# Altium schematic sheet 1_ENTRADA_DE_ALIMENTACAO.SchDoc
size Tabloid; SheetNumber: 1; SheetTotal: 5; SPICEModelCacheBKPNJEUB: <root> / <DocumentId>BKPNJEUB</DocumentId> / <CacheFrame Number="0"> / <Model Name="0603_885012206095_100nf" Kind="CKT"> / <Text>******* / .subckt 0603_885012206095_100nF 1 2 / Rser 1 3 0.0157659152881 / Lser 2 4 3.10171966E-10 / C1 3 4 0.0000001 / Rpar 3 4 5000000000 / .ends 0603_885012206095_100nF</Text> / </Model> / <Model Name="0805_150080rs75000" Kind="CKT"> / <Text>****** / .subckt 0805_150080RS75000  1  2 / D1 1 2 SMCW / .MODEL SMCW D / + IS=10.000E-21 / + N=1.6992 / + RS=1.0000E-6 / + IKF=1.2373E-3 / + CJO=1.0000E-12 / + M=.3333 / + VJ=.75 / + BV=5 / + IBV=10.00E-6 / + TT=5.0000E-9 / .ends</Text> / </Model> / <Model Name="0805_885012207103r_1uf" Kind="CKT"> / <Text>******* / .subckt 0805_885012207103R_1uF 1 2 / Rser 1 3 0.0053065272233 / Lser 2 4 2.83466289E-10 / C1 3 4 0.000001 / Rpar 3 4 100000000 / .ends 0805_885012207103R_1uF</Text> / </Model> / <Model Name="0805_885012207102_470nf" Kind="CKT"> / <Text>******* / .subckt 0805_885012207102_470nF 1 2 / Rser 1 3 0.00874819634126 / Lser 2 4 0.000000000465 / C1 3 4 0.00000047 / Rpar 3 4 1100000000 / .ends 0805_885012207102_470nF</Text> / </Model> / <Model Name="3015_78438335470_47u" Kind="CKT"> / <Text>******* / .subckt 3015_78438335470_47u 1 2 / Rp 1 2 42066.66667 / Cp 1 2 7.59833333333333p / Rs 1 N3 2.09 / L1 N3 2 46.1u / .ends 3015_78438335470_47u</Text> / </Model> / <Model Name="0603_885012206022_220nf" Kind="CKT"> / <Text>******* / .subckt 0603_885012206022_220nF 1 2 / Rser 1 3 0.0146862228843 / Lser 2 4 4.43010481E-10 / C1 3 4 0.00000022 / Rpar 3 4 2300000000 / .ends 0603_885012206022_220nF</Text> / </Model> / <Model Name="0603_885012206027_2.2uf" Kind="CKT"> / <Text>******* / .subckt 0603_885012206027_2.2uF 1 2 / Rser 1 3 0.00844425861819 / Lser 2 4 2.90335669E-10 / C1 3 4 0.0000022 / Rpar 3 4 20000000 / .ends 0603_885012206027_2.2uF</Text> / </Model> / </CacheFrame> / </root>
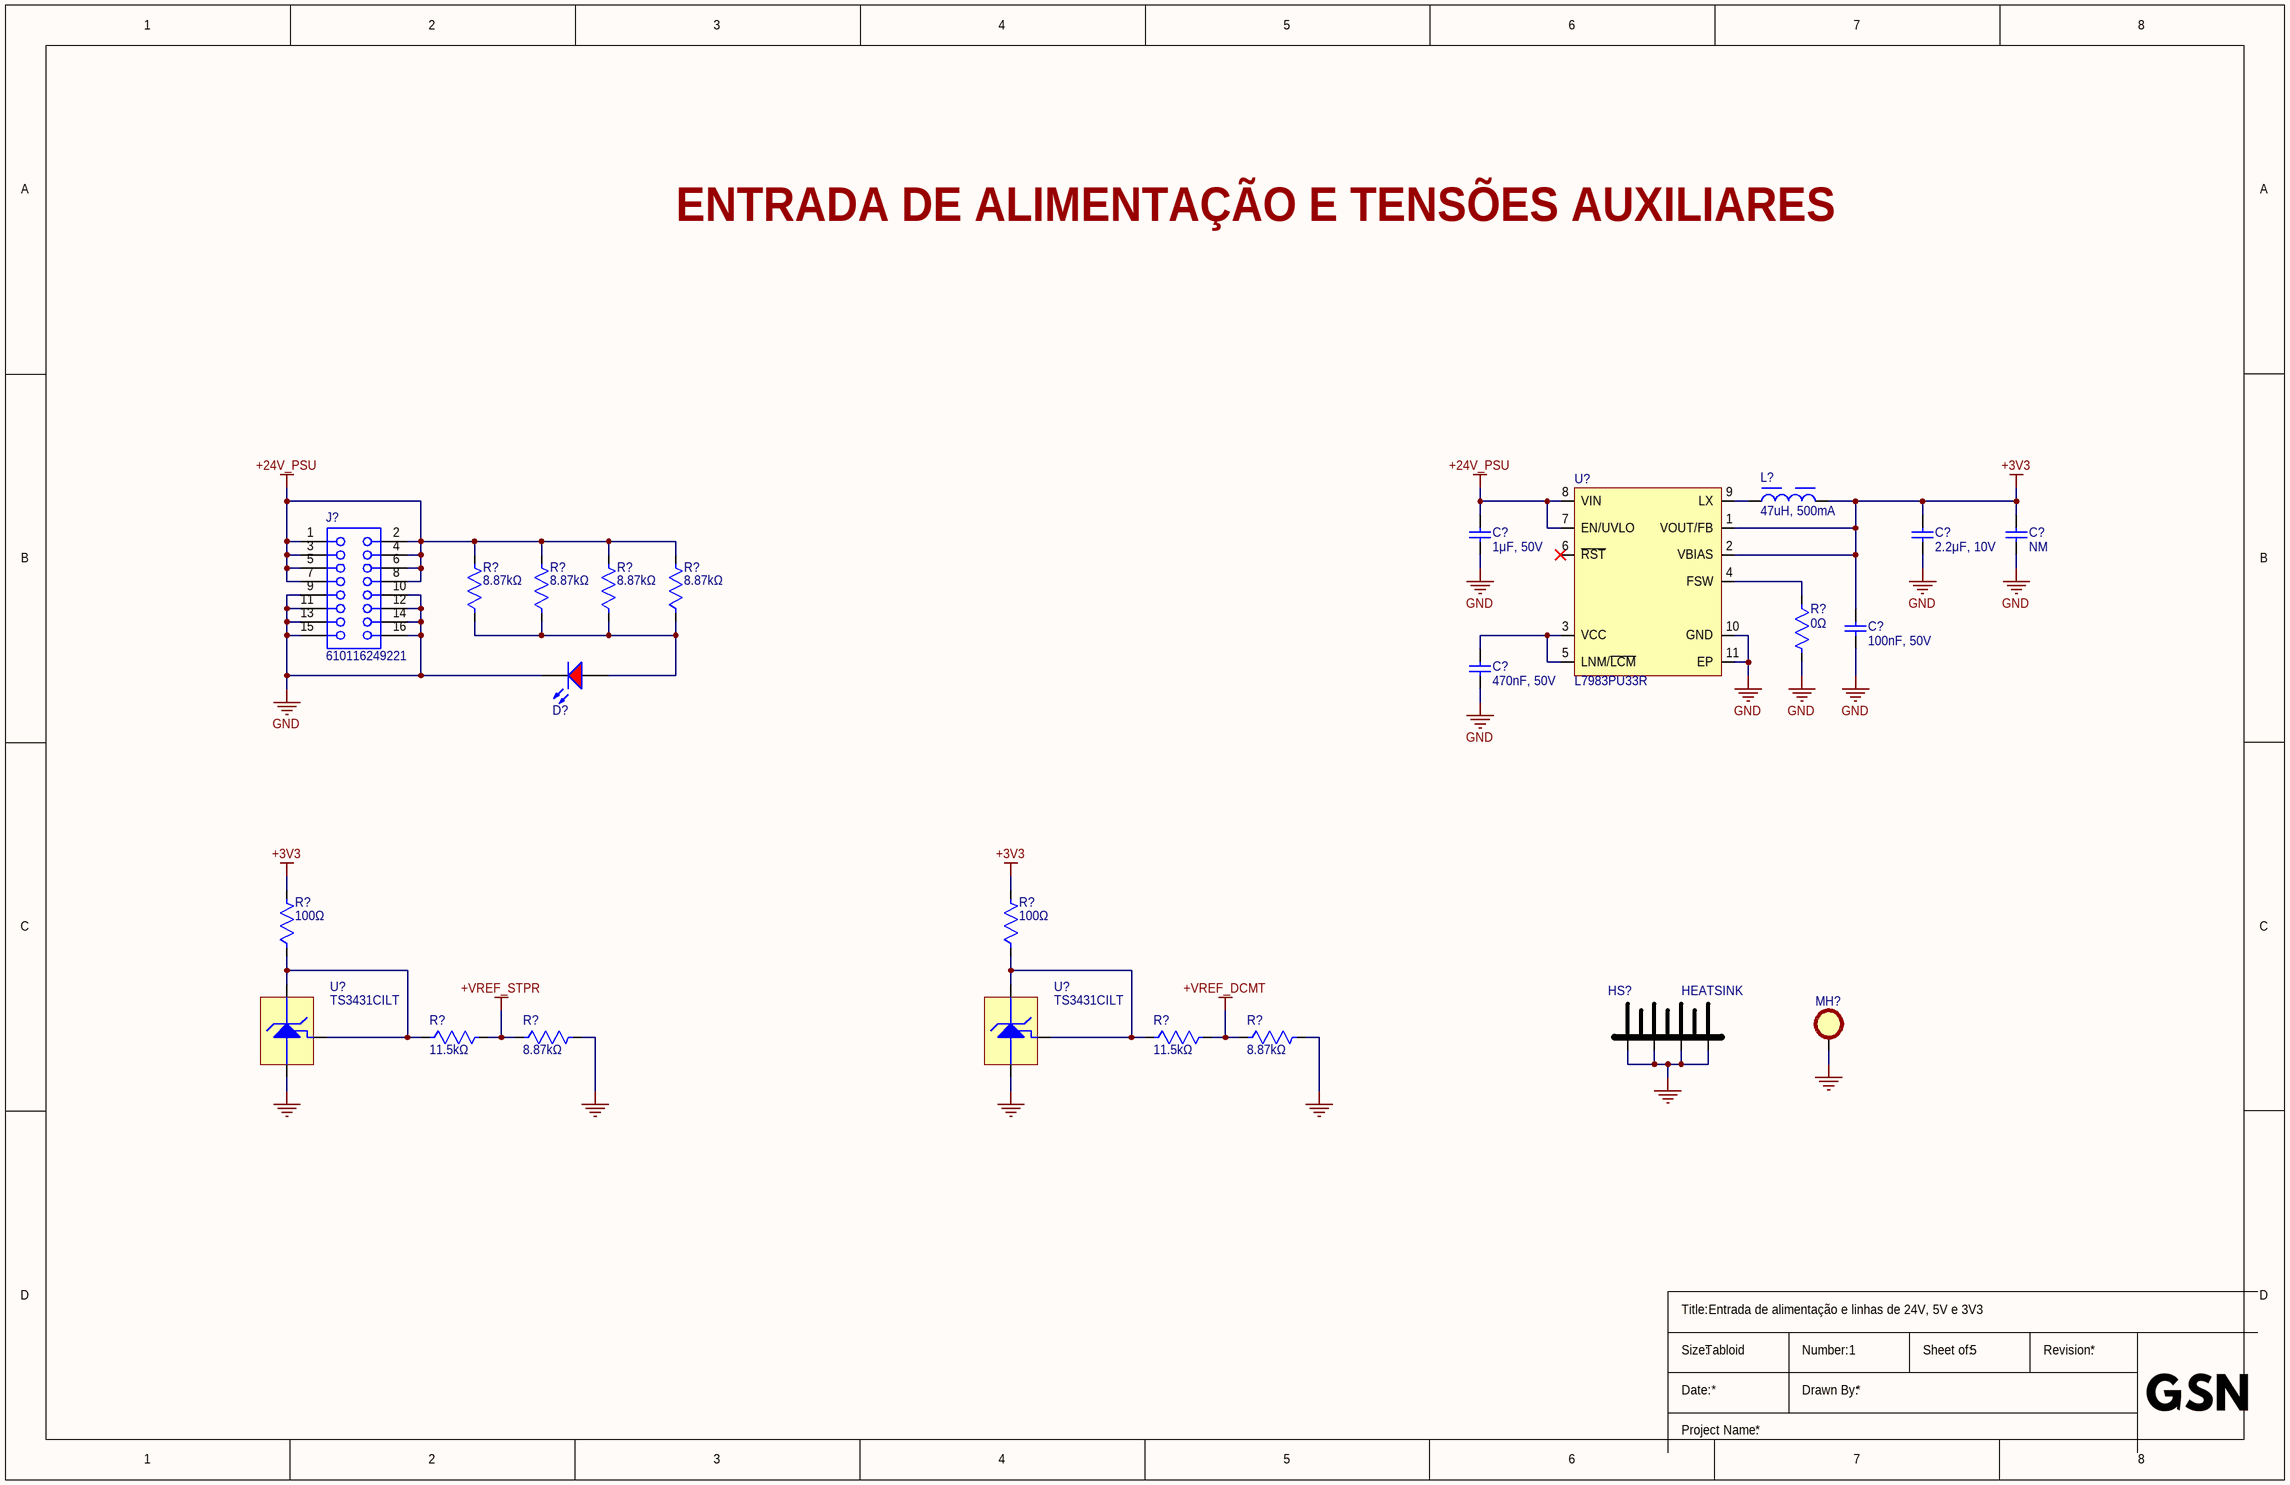
[diagram p0: 1_ENTRADA_DE_ALIMENTACAO.SchDoc]

## Parts
(Parts that share a designator on the sheet are numbered #1, #2 ... from top to bottom, then left to right.)
C?#1  1μF, 50V  [WCAP-CSGP_0805_L2W1.25H1.25]
C?#2  2.2μF, 10V  [WCAP-CSGP_0603_L1.6W0.8H0.8_Reflow]
C?#3  NM  [WCAP-CSGP_0603_L1.6W0.8H0.8_Reflow]
C?#4  100nF, 50V  [WCAP-CSGP_0603_L1.6W0.8H0.8_Reflow]
C?#5  470nF, 50V  [WCAP-CSGP_0805_L2W1.25H1.25]
D?  Red, 2V, 140°  [WL-SMCW_0805_150080xx75000]  (value not drawn)
HS?  HEATSINK  [HEATSINK_100MM_60MM_10MM_LAYING_DOWN]
J?  610116249221  [610116249221]
L?  47uH, 500mA  [WE-MAIA_3015]
MH?  Mounting Hole 2.5mm  [MOUNTING_HOLE_M2P5_PLATED]  (value not drawn)  (no BOM)
R?#1  0Ω  [0603-REFLOW]
R?#2  8.87kΩ  [0805-REFLOW]
R?#3  8.87kΩ  [0805-REFLOW]
R?#4  8.87kΩ  [0805-REFLOW]
R?#5  8.87kΩ  [0805-REFLOW]
R?#6  100Ω  [0603-REFLOW]
R?#7  100Ω  [0603-REFLOW]
R?#8  11.5kΩ  [0603-REFLOW]
R?#9  8.87kΩ  [0603-REFLOW]
R?#10  11.5kΩ  [0603-REFLOW]
R?#11  8.87kΩ  [0603-REFLOW]
U?#1  L7983PU33R  [10-WFDFN-EP]
U?#2  TS3431CILT  [SOT-23-3]
U?#3  TS3431CILT  [SOT-23-3]

## Nets
+3V3: C?#2.2 C?#3.2 C?#4.2 L?.2 R?#6.2 R?#7.2 U?#1.1(VOUT/FB) U?#1.2(VBIAS)
+24V_PSU: C?#1.2 J?.1 J?.2 J?.3 J?.4 J?.5 J?.6 J?.7 J?.8 R?#2.2 R?#3.2 R?#4.2 R?#5.2 U?#1.7(EN/UVLO) U?#1.8(VIN)
+VREF_DCMT: R?#10.2 R?#11.1
+VREF_STPR: R?#8.2 R?#9.1
GND: C?#1.1 C?#2.1 C?#3.1 C?#4.1 C?#5.1 D?.1(K) HS?.H1 HS?.H2 HS?.H3 HS?.H4 J?.9 J?.10 J?.11 J?.12 J?.13 J?.14 J?.15 J?.16 MH?.H R?#1.2 R?#9.2 R?#11.2 U?#1.10(GND) U?#1.11(EP) U?#2.3(ANODE) U?#3.3(ANODE)
NetC?#5_2: C?#5.2 U?#1.3(VCC) U?#1.5(LNM/~{LCM})
NetD?_2: D?.2(A) R?#2.1 R?#3.1 R?#4.1 R?#5.1
NetL?_1: L?.1 U?#1.9(LX)
NetR?#1_1: R?#1.1 U?#1.4(FSW)
NetR?#6_1: R?#6.1 R?#8.1 U?#2.1(REF) U?#2.2(CATHODE)
NetR?#7_1: R?#7.1 R?#10.1 U?#3.1(REF) U?#3.2(CATHODE)

Not connected (* = marked no-connect by the designer): U?#1 6(~{RST})*

## Notes on the sheet
- ENTRADA DE ALIMENTAÇÃO E TENSÕES AUXILIARES
- Entrada de alimentação e linhas de 24V, 5V e 3V3
- Title:
- Size:
- Tabloid
- Number:
- Sheet of:
- Revision:
- Date:
- Project Name:
- Drawn By:

## Library data of the parts
C?#1 = 885012207103R: WCAP-CSGP Multilayer Ceramic Chip Capacitor, General Purpose, size 0805, 1μF, 50V; Manufacturer: Wurth Elektronik; Case/Size Code: 0805; Capacitance: 1uF; Capacitance Tolerance: +/-10%; Ceramic Type: X7R; Dissipation Factor: 10%; Insulation Resistance: 0.1Gohm; Technical Reference: X7R0805105K050DFCT20000; Manufacturer Part Number: 885012207103R; Category: Multilayer Ceramic Chip Capacitors; Match Code: WCAP-CSGP; ComponentLink1Description: Website Link; ComponentLink1URL: https://www.we-online.com/redexpert/article/885012207103R?ad; ComponentLink2Description: Datasheet Link; ComponentLink2URL: https://www.we-online.com/redexpert/spec/885012207103R?ad; Mount: Surface Mount; Operating Temperature Min: -55degC; Operating Temperature Max: 125degC; Packaging: Tape and Reel; Length: 2mm; Width: 1.25mm; Height: 1.25mm; Rated Voltage (DC): 50V
C?#2 = 885012206027: WCAP-CSGP Multilayer Ceramic Chip Capacitor, General Purpose, size 0603, 2.2μF, 10V; Manufacturer: Wurth Elektronik; Case/Size Code: 0603; Capacitance: 2.2uF; Capacitance Tolerance: +/-10%; Ceramic Type: X7R; Dissipation Factor: 10%; Insulation Resistance: 0.02Gohm; Technical Reference: X7R0603225K010DFCT10000; Manufacturer Part Number: 885012206027; Category: Multilayer Ceramic Chip Capacitors; Match Code: WCAP-CSGP; ComponentLink1Description: Website Link; ComponentLink1URL: https://www.we-online.com/redexpert/article/885012206027?ad; ComponentLink2Description: Datasheet Link; ComponentLink2URL: https://www.we-online.com/redexpert/spec/885012206027?ad; Mount: Surface Mount; Operating Temperature Min: -55degC; Operating Temperature Max: 125degC; Packaging: Tape and Reel; Length: 1.6mm; Width: 0.8mm; Height: 0.8mm; Rated Voltage (DC): 10V
C?#3 = 885012206022: WCAP-CSGP Multilayer Ceramic Chip Capacitor, General Purpose, size 0603, 220nF, 10V; Manufacturer: Wurth Elektronik; Case/Size Code: 0603; Capacitance Tolerance: +/-10%; Ceramic Type: X7R; Dissipation Factor: 5%; Insulation Resistance: 2.3Gohm; Technical Reference: X7R0603224K010DFCT10000; Manufacturer Part Number: 885012206022; Category: Multilayer Ceramic Chip Capacitors; Match Code: WCAP-CSGP; ComponentLink1Description: Website Link; ComponentLink1URL: https://www.we-online.com/redexpert/article/885012206022?ad; ComponentLink2Description: Datasheet Link; ComponentLink2URL: https://www.we-online.com/redexpert/spec/885012206022?ad; Mount: Surface Mount; Operating Temperature Min: -55degC; Operating Temperature Max: 125degC; Packaging: Tape and Reel; Length: 1.6mm; Width: 0.8mm; Height: 0.8mm; Capacitance: 220nF; Rated Voltage (DC): 10V
C?#4 = 885012206095: WCAP-CSGP Multilayer Ceramic Chip Capacitor, General Purpose, size 0603, 100nF, 50V; Manufacturer: Wurth Elektronik; Case/Size Code: 0603; Capacitance Tolerance: +/-10%; Ceramic Type: X7R; Dissipation Factor: 3%; Insulation Resistance: 5Gohm; Technical Reference: X7R0603104K050DFCT10000; Manufacturer Part Number: 885012206095; Category: Multilayer Ceramic Chip Capacitors; Match Code: WCAP-CSGP; ComponentLink1Description: Website Link; ComponentLink1URL: https://www.we-online.com/redexpert/article/885012206095?ad; ComponentLink2Description: Datasheet Link; ComponentLink2URL: https://www.we-online.com/redexpert/spec/885012206095?ad; Mount: Surface Mount; Operating Temperature Min: -55degC; Operating Temperature Max: 125degC; Packaging: Tape and Reel; Length: 1.6mm; Width: 0.8mm; Height: 0.8mm; Capacitance: 100nF; Rated Voltage (DC): 50V
C?#5 = 885012207102: WCAP-CSGP Multilayer Ceramic Chip Capacitor, General Purpose, size 0805, 470nF, 50V; Manufacturer: Wurth Elektronik; Case/Size Code: 0805; Capacitance Tolerance: +/-10%; Ceramic Type: X7R; Dissipation Factor: 3%; Insulation Resistance: 1.1Gohm; Technical Reference: X7R0805474K050DFCT10000; Manufacturer Part Number: 885012207102; Category: Multilayer Ceramic Chip Capacitors; Match Code: WCAP-CSGP; ComponentLink1Description: Website Link; ComponentLink1URL: https://www.we-online.com/redexpert/article/885012207102?ad; ComponentLink2Description: Datasheet Link; ComponentLink2URL: https://www.we-online.com/redexpert/spec/885012207102?ad; Mount: Surface Mount; Operating Temperature Min: -55degC; Operating Temperature Max: 125degC; Packaging: Tape and Reel; Length: 2mm; Width: 1.25mm; Height: 1.25mm; Capacitance: 470nF; Rated Voltage (DC): 50V
D? = 150080RS75000: WL-SMCW Mono-color Chip LED Waterclear, SMT, size 0805, Red, 2V, 140°; Manufacturer: Wurth Elektronik; Case/Size Code: 0805; Chip Technology: AlInGaP; Dominant Wavelength: 625nm; Luminous Intensity: 150mcd; Peak Wavelength: 630nm; Manufacturer Part Number: 150080RS75000; Category: Signal LEDs; Match Code: WL-SMCW; ComponentLink1Description: Website Link; ComponentLink1URL: https://www.we-online.com/redexpert/article/150080RS75000?ad; ComponentLink2Description: Datasheet Link; ComponentLink2URL: https://www.we-online.com/redexpert/spec/150080RS75000?ad; Mount: Surface Mount; Min Operating Temperature: -40°C; Max Operating Temperature: 85°C; Packaging: Tape and Reel; Length: 2mm; Width: 1.25mm; Height: 0.7mm; Emitting Color: Red; Forward Voltage: 2V; Viewing Angle: 140°
HS? = GENERIC-HEATSINK-100X60X10MM-LD: GENERIC HEATSINK 100X60X10MM; Manufacturer: OEM; Manufacturer Part Number: None
J? = 610116249221: WR-PHD Socket Header, SMT, Angled, pitch 2.54mm, 2 Row, 16P; Manufacturer: Wurth Elektronik; Contact Resistance: 20mOhm; Rated Current: 3A; Working Voltage: 250V; Withstanding Voltage: 600V; Manufacturer Part Number: 610116249221; Category: Board-to-Board Connectors; Match Code: WR-PHD; ComponentLink1Description: Website Link; ComponentLink1URL: https://www.we-online.com/redexpert/article/610116249221?ad; ComponentLink2Description: Datasheet Link; ComponentLink2URL: https://www.we-online.com/redexpert/spec/610116249221?ad; Mount: Surface Mount; Operating Temperature Min: -40degC; Operating Temperature Max: 105degC; Packaging: Tape and Reel; Gender: Socket Header; Number of Pins: 16; Number of Rows: 2; Orientation: Angled; Lead Pitch: 2.54mm
L? = 78438335470: WE-MAIA SMT Power Inductor, size 3015, 47uH, 0.5A, 2300mohm; Manufacturer: Wurth Elektronik; Case/Size Code: 3015; Saturation Current @ 10%: 0.75A; Saturation Current @ 30%: 1.5A; Self Resonant Frequency: 8MHz; Manufacturer Part Number: 78438335470; Category: Power Inductors; Match Code: WE-MAIA; ComponentLink1Description: Website Link; ComponentLink1URL: https://www.we-online.com/redexpert/article/78438335470?ad; ComponentLink2Description: Datasheet Link; ComponentLink2URL: https://www.we-online.com/redexpert/spec/78438335470?ad; Mount: Surface Mount; Operating Temperature Min: -40degC; Operating Temperature Max: 125degC; Packaging: Tape and Reel; Length: 3mm; Width: 3mm; Height: 1.5mm; Automotive: Yes; DC Resistance Max: 2300mohm; Inductance: 47uH; Rated Current: 0.5A
MH? = MTH-2P5MM-PLATED: PLATED MOUNTING HOLE WITH 2.5MM DIAMETER
R?#1 = RC0603FR-070RL: RES 0 OHM 1% 1/10W 0603; Manufacturer: Yageo Group; Max Power Dissipation: 100mW; Temperature Coefficient: ±200ppm/°C; Voltage Rating (AC): 50V; Voltage Rating: 75V; Supplier Part Number: 311-0.0HRCT-ND; Manufacturer Part Number: RC0603FR-070RL; Value: 0Ω; Case Code (Imperial): 0603; Case Code (Metric): 1608; Case/Package: 0603; Category: Chip SMD Resistors; China RoHS: Non-Compliant; Composition: Thick Film; Contact Plating: Tin; Depth: 800µm; Features: Moisture Resistant; Height: 450µm; Lead Free: Lead Free; Length: 1.6mm; Lifecycle Status: Production; Max Operating Temperature: 155°C; Military Standard: Not; Min Operating Temperature: -55°C; Mounting Technology: Surface Mount; Number of Terminals: 2; Number of Terminations: 2; Packaging: Tape & Reel; Power Dissipation: 100mW; Power Rating: 100mW; Radiation Hardening: No; REACH SVHC: Yes; RoHS: Compliant; Supplier: DigiKey; Termination: SMD/SMT; Tolerance: 1%; Component Link Description: https://www.yageogroup.com/content/datasheet/asset/file/PYU-RC_GROUP_51_ROHS_L; Component Link URL: https://www.yageogroup.com/content/datasheet/asset/file/PYU-RC_GROUP_51_ROHS_L; Datasheet: https://www.yageogroup.com/content/datasheet/asset/file/PYU-RC_GROUP_51_ROHS_L; Voltage Rating (DC): 50V; Weight: 2.012816mg; Width: 800µm; Working Voltage: 75V
R?#2-R?#5 = RC0805FR-078K87L: RES 8.87K OHM 1% 1/8W 0805; Manufacturer: Yageo Group; Max Power Dissipation: 125mW; Temperature Coefficient: 100ppm/°C; Voltage Rating: 150V; Supplier: DigiKey; Supplier Part Number: 311-8.87KCRCT-ND; Manufacturer Part Number: RC0805FR-078K87L; RoHS: Compliant; Category: Chip SMD Resistors; Stock: 98675; Pricing: 1=0.1, 10=0.008, 25=0.0072 (USD); Case/Package: 0805; Case Code (Imperial): 0805; China RoHS: Non-Compliant; Composition: Thick Film; Contact Plating: Lead, Tin; Depth: 1.25mm; Features: Moisture Resistant; Height: 500µm; Lead Free: Lead Free; Length: 2mm; Lifecycle Status: Production; Max Operating Temperature: 155°C; Military Standard: Not; Min Operating Temperature: -55°C; Mounting Technology: Surface Mount; Number of Terminals: 2; Number of Terminations: 2; Power Dissipation: 125mW; Power Rating: 125mW; Radiation Hardening: No; REACH SVHC: Yes; Value: 8.87kΩ; Schedule B: 8533210045, 8533210045|8533210045|8533210045|8533210045|8533210045; Termination: SMD/SMT; Tolerance: 1%; Voltage Rating (DC): 150V; Width: 1.25mm; Working Voltage: 150V; ComponentLink1URL: https://datasheet.octopart.com:443/RC0805FR-078K87L-Yageo-datasheet-175887523.pdf?src-supplier=Newark; ComponentLink1Description: https://datasheet.octopart.com:443/RC0805FR-078K87L-Yageo-datasheet-175887523.pdf?src-supplier=Newark; ComponentLink2URL: https://datasheet.octopart.com:443/RC0805FR-078K87L-Yageo-datasheet-103092701.pdf?src-supplier=Upverter; ComponentLink2Description: https://datasheet.octopart.com:443/RC0805FR-078K87L-Yageo-datasheet-103092701.pdf?src-supplier=Upverter; ComponentLink3URL: https://datasheet.octopart.com:443/RC0805FR-078K87L-Yageo-Group-datasheet-176638170.pdf?src-supplier=Future+Electronics; ComponentLink3Description: https://datasheet.octopart.com:443/RC0805FR-078K87L-Yageo-Group-datasheet-176638170.pdf?src-supplier=Future+Electronics; ComponentLink4URL: https://datasheet.octopart.com:443/RC0805FR-078K87L-Yageo-datasheet-164759695.pdf?src-supplier=Future+Electronics; ComponentLink4Description: https://datasheet.octopart.com:443/RC0805FR-078K87L-Yageo-datasheet-164759695.pdf?src-supplier=Future+Electronics; ComponentLink5URL: https://datasheet.octopart.com:443/RC0805FR-078K87L-Yageo-datasheet-12592811.pdf?src-supplier=Future+Electronics; ComponentLink5Description: https://datasheet.octopart.com:443/RC0805FR-078K87L-Yageo-datasheet-12592811.pdf?src-supplier=Future+Electronics; ComponentLink6URL: https://datasheet.octopart.com:443/RC0805FR-078K87L-Yageo-datasheet-8330313.pdf?src-supplier=Future+Electronics; ComponentLink6Description: https://datasheet.octopart.com:443/RC0805FR-078K87L-Yageo-datasheet-8330313.pdf?src-supplier=Future+Electronics; ComponentLink7URL: https://datasheet.octopart.com:443/RC0805FR-078K87L-Yageo-datasheet-8324252.pdf?src-supplier=Future+Electronics; ComponentLink7Description: https://datasheet.octopart.com:443/RC0805FR-078K87L-Yageo-datasheet-8324252.pdf?src-supplier=Future+Electronics; ComponentLink8URL: https://datasheet.octopart.com/RC0805FR-078K87L-Yageo-datasheet-73766026.pdf; ComponentLink8Description: https://datasheet.octopart.com/RC0805FR-078K87L-Yageo-datasheet-73766026.pdf; ComponentLink9URL: https://datasheet.octopart.com:443/RC0805FR-078K87L-Yageo-datasheet-118657.pdf?src-supplier=DigiKey; ComponentLink9Description: https://datasheet.octopart.com:443/RC0805FR-078K87L-Yageo-datasheet-118657.pdf?src-supplier=DigiKey; ComponentLink10URL: http://sigma.octopart.com:80/conflict_mineral_statement/Yageo-company-3.pdf?src-supplier=Compliance+Statements; ComponentLink10Description: http://sigma.octopart.com:80/conflict_mineral_statement/Yageo-company-3.pdf?src-supplier=Compliance+Statements; ComponentLink11URL: http://sigma.octopart.com:80/rohs_statement/Yageo-company-2.pdf?src-supplier=Compliance+Statements; ComponentLink11Description: http://sigma.octopart.com:80/rohs_statement/Yageo-company-2.pdf?src-supplier=Compliance+Statements
R?#6 R?#7 = RC0603FR-07100RL: RES 100 OHM 1% 1/10W 0603; Manufacturer: Yageo Group; Max Power Dissipation: 100mW; Temperature Coefficient: ±200ppm/°C; Voltage Rating (AC): 50V; Voltage Rating: 75V; Supplier Part Number: 311-100HRCT-ND; Manufacturer Part Number: RC0603FR-07100RL; Value: 100Ω; Case Code (Imperial): 0603; Case Code (Metric): 1608; Case/Package: 0603; Category: Chip SMD Resistors; China RoHS: Non-Compliant; Composition: Thick Film; Contact Plating: Tin; Depth: 800µm; Features: Moisture Resistant; Height: 450µm; Lead Free: Lead Free; Length: 1.6mm; Lifecycle Status: Production; Max Operating Temperature: 155°C; Military Standard: Not; Min Operating Temperature: -55°C; Mounting Technology: Surface Mount; Number of Terminals: 2; Number of Terminations: 2; Packaging: Tape & Reel; Power Dissipation: 100mW; Power Rating: 100mW; Radiation Hardening: No; REACH SVHC: Yes; RoHS: Compliant; Supplier: DigiKey; Termination: SMD/SMT; Tolerance: 1%; Component Link Description: https://www.yageogroup.com/content/datasheet/asset/file/PYU-RC_GROUP_51_ROHS_L; Component Link URL: https://www.yageogroup.com/content/datasheet/asset/file/PYU-RC_GROUP_51_ROHS_L; Datasheet: https://www.yageogroup.com/content/datasheet/asset/file/PYU-RC_GROUP_51_ROHS_L; Voltage Rating (DC): 50V; Weight: 2.012816mg; Width: 800µm; Working Voltage: 75V
R?#8 R?#10 = RC0603FR-0711K5L: RES 11.5K OHM 1% 1/10W 0603; Manufacturer: Yageo Group; Max Power Dissipation: 100mW; Temperature Coefficient: ±200ppm/°C; Voltage Rating (AC): 50V; Voltage Rating: 75V; Supplier Part Number: 311-11.5KHRCT-ND; Manufacturer Part Number: RC0603FR-0711K5L; Value: 11.5kΩ; Case Code (Imperial): 0603; Case Code (Metric): 1608; Case/Package: 0603; Category: Chip SMD Resistors; China RoHS: Non-Compliant; Composition: Thick Film; Contact Plating: Tin; Depth: 800µm; Features: Moisture Resistant; Height: 450µm; Lead Free: Lead Free; Length: 1.6mm; Lifecycle Status: Production; Max Operating Temperature: 155°C; Military Standard: Not; Min Operating Temperature: -55°C; Mounting Technology: Surface Mount; Number of Terminals: 2; Number of Terminations: 2; Packaging: Tape & Reel; Power Dissipation: 100mW; Power Rating: 100mW; Radiation Hardening: No; REACH SVHC: Yes; RoHS: Compliant; Supplier: DigiKey; Termination: SMD/SMT; Tolerance: 1%; Component Link Description: https://www.yageogroup.com/content/datasheet/asset/file/PYU-RC_GROUP_51_ROHS_L; Component Link URL: https://www.yageogroup.com/content/datasheet/asset/file/PYU-RC_GROUP_51_ROHS_L; Datasheet: https://www.yageogroup.com/content/datasheet/asset/file/PYU-RC_GROUP_51_ROHS_L; Voltage Rating (DC): 50V; Weight: 2.012816mg; Width: 800µm; Working Voltage: 75V
R?#9 R?#11 = RC0603FR-078K87L: RES 8.87K OHM 1% 1/10W 0603; Manufacturer: Yageo Group; Max Power Dissipation: 100mW; Temperature Coefficient: ±200ppm/°C; Voltage Rating (AC): 50V; Voltage Rating: 75V; Supplier Part Number: 311-8.87KHRCT-ND; Manufacturer Part Number: RC0603FR-078K87L; Value: 8.87kΩ; Case Code (Imperial): 0603; Case Code (Metric): 1608; Case/Package: 0603; Category: Chip SMD Resistors; China RoHS: Non-Compliant; Composition: Thick Film; Contact Plating: Tin; Depth: 800µm; Features: Moisture Resistant; Height: 450µm; Lead Free: Lead Free; Length: 1.6mm; Lifecycle Status: Production; Max Operating Temperature: 155°C; Military Standard: Not; Min Operating Temperature: -55°C; Mounting Technology: Surface Mount; Number of Terminals: 2; Number of Terminations: 2; Packaging: Tape & Reel; Power Dissipation: 100mW; Power Rating: 100mW; Radiation Hardening: No; REACH SVHC: Yes; RoHS: Compliant; Supplier: DigiKey; Termination: SMD/SMT; Tolerance: 1%; Component Link Description: https://www.yageogroup.com/content/datasheet/asset/file/PYU-RC_GROUP_51_ROHS_L; Component Link URL: https://www.yageogroup.com/content/datasheet/asset/file/PYU-RC_GROUP_51_ROHS_L; Datasheet: https://www.yageogroup.com/content/datasheet/asset/file/PYU-RC_GROUP_51_ROHS_L; Voltage Rating (DC): 50V; Weight: 2.012816mg; Width: 800µm; Working Voltage: 75V
U?#1 = L7983PU33R: IC REG BUCK 3.3V 300MA 10DFN; Manufacturer: STMicroelectronics; Max Supply Voltage: 60V; Max Switching Frequency: 2.42MHz; Min Input Voltage: 3.5V; Min Output Voltage: 850mV; Nominal Supply Voltage: 24V; Number of Circuits: 1; Quiescent Current: 10µA; Synchronous Rectifier: Yes; Supplier: DigiKey; Supplier Part Number: 497-L7983PU33RCT-ND; Manufacturer Part Number: L7983PU33R; RoHS: Compliant; Category: Voltage Regulators - Switching; Stock: 4366; Pricing: 1=2.69, 10=2.001, 25=1.83, 100=1.6411, 250=1.55108, 500=1.5155 (USD); China RoHS: Compliant; Country of Origin: Mainland China; Export Control Classification Number (ECCN) Code: EAR99; Height - Seated (Max): 800µm; Harmonized Tariff Schedule (HTS) Code: 8542.39.00.60; Introduction Date: 2020-10-06; Length: 3mm; Lifecycle Status: Production; Max Operating Temperature: 150°C; Max Output current: 300mA; Max Output Voltage: 60V; Min Operating Temperature: -40°C; Nominal Output Voltage: 3.3V; Number of Terminals: 10; Output Current: 300mA; Packaging: Tape and Reel; REACH SVHC: Yes; Schedule B: 8542390000, 8542390000|8542390000|8542390000|8542390000|8542390000|8542390000|8542390000|8542390000|8542390000|8542390000|8542390000|8542390000|8542390000|8542390000|8542390000|8542390000|8542390000|8542390000|8542390000|8542390000|8542390000|8542390000|8542390000|85; Terminal Pitch: 500µm; Topology: Buck; Width: 3mm
U?#2 U?#3 = TS3431CILT: IC VREF SHUNT ADJ 0.25% SOT23-3; Manufacturer: STMicroelectronics; Cathode Current: 400µA; Max Supply Voltage: 25V; Max Output current: 100mA; Max Output Voltage: 1.243V; Min Output Voltage: 1.237V; Min Supply Voltage: 1.24V; Number of Channels: 1; Output Voltage: 24V; Reference Type: Adjustable, Shunt; Temperature Coefficient: 100ppm/°C; Supplier: DigiKey; Supplier Part Number: 497-4637-1-ND; Manufacturer Part Number: TS3431CILT; RoHS: Compliant; Category: Voltage References; Stock: 16066; Pricing: 1=0.62, 10=0.44, 25=0.3944, 100=0.3441, 250=0.32016, 500=0.30574, 1000=0.29386 (USD); Case/Package: SOT-23; China RoHS: Compliant; Height: 1.02mm; Height - Seated (Max): 1.12mm; Lead Free: Lead Free; Length: 2.9mm; Lifecycle Status: Production; Max Operating Temperature: 125°C; Min Operating Temperature: -40°C; Mounting Technology: Surface Mount; Nominal Supply Voltage: 1.24V; Nominal Output Voltage: 1.24V; Nominal Supply Current: 400µA; Number of Circuits: 1; Number of Outputs: 1; Pins: 3; Number of Terminals: 3; Output Current: 100mA; Packaging: Tape and Reel; Radiation Hardening: No; REACH SVHC: Yes; Reference Voltage: 1.24V; Schedule B: 8542390000, 8542390000|8542390000|8542390000|8542390000|8542390000; Terminal Pitch: 950µm; Termination: SMD/SMT; Tolerance: 0.25%; Width: 1.3mm; ComponentLink1URL: https://datasheet.octopart.com:443/TS3431CILT-STMicroelectronics-datasheet-12523092.pdf?src-supplier=SHENGYU+ELECTRONICS; ComponentLink1Description: https://datasheet.octopart.com:443/TS3431CILT-STMicroelectronics-datasheet-12523092.pdf?src-supplier=SHENGYU+ELECTRONICS; ComponentLink2URL: https://datasheet.octopart.com:443/TS3431CILT-STMicroelectronics-datasheet-10408717.pdf?src-supplier=Upverter; ComponentLink2Description: https://datasheet.octopart.com:443/TS3431CILT-STMicroelectronics-datasheet-10408717.pdf?src-supplier=Upverter; ComponentLink3URL: https://datasheet.octopart.com:443/TS3431CILT-STMicroelectronics-datasheet-124172.pdf?src-supplier=Farnell; ComponentLink3Description: https://datasheet.octopart.com:443/TS3431CILT-STMicroelectronics-datasheet-124172.pdf?src-supplier=Farnell; ComponentLink4URL: https://datasheet.octopart.com:443/TS3431CILT-STMicroelectronics-datasheet-140368796.pdf?src-supplier=TME; ComponentLink4Description: https://datasheet.octopart.com:443/TS3431CILT-STMicroelectronics-datasheet-140368796.pdf?src-supplier=TME; ComponentLink5URL: https://datasheet.octopart.com:443/TS3431CILT-STMicroelectronics-datasheet-18487.pdf?src-supplier=DigiKey; ComponentLink5Description: https://datasheet.octopart.com:443/TS3431CILT-STMicroelectronics-datasheet-18487.pdf?src-supplier=DigiKey